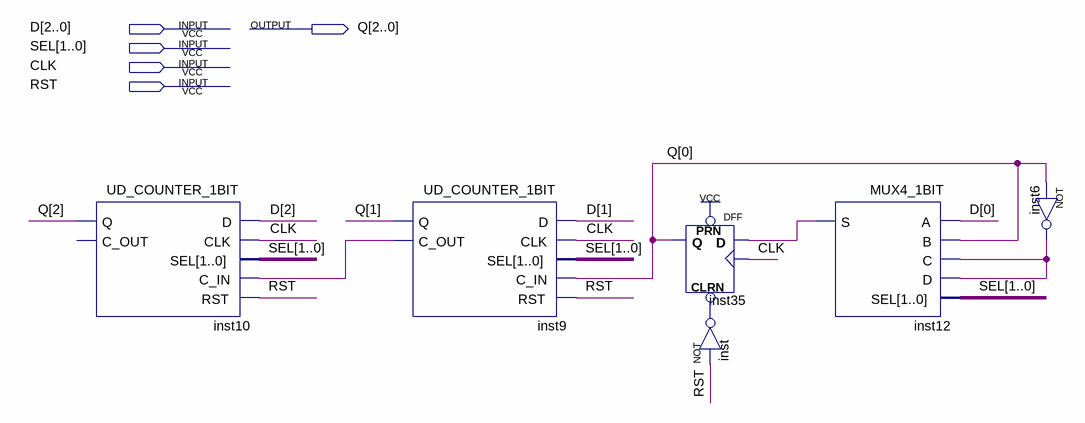
[diagram p0: schematic sheet]
// Quartus schematic UD_COUNTER_3BIT.bdf as structural Verilog: 6 symbols, 5 pins
module UD_COUNTER_3BIT (
  input  [2:0] D,
  input  [1:0] SEL,
  input  CLK,
  input  RST,
  output [2:0] Q
);

  wire inst6_out, inst9_c_out, inst12_s, inst_out;

  UD_COUNTER_1BIT inst10 (.D(D[2]), .CLK(CLK), .SEL(SEL), .C_IN(inst9_c_out), .RST(RST), .Q(Q[2]));  // open: C_OUT
  UD_COUNTER_1BIT inst9 (.D(D[1]), .CLK(CLK), .SEL(SEL), .C_IN(Q[0]), .RST(RST), .Q(Q[1]), .C_OUT(inst9_c_out));
  DFF inst35 (.CLRN(inst_out), .CLK(CLK), .D(inst12_s), .PRN(1'b1), .Q(Q[0]));
  not inst (inst_out, RST);
  MUX4_1BIT inst12 (.A(D[0]), .B(Q[0]), .C(inst6_out), .D(inst6_out), .SEL(SEL), .S(inst12_s));
  not inst6 (inst6_out, Q[0]);
endmodule
